# EAGLE design OLM-base-v.REVH-SMT (EAGLE 6.4)
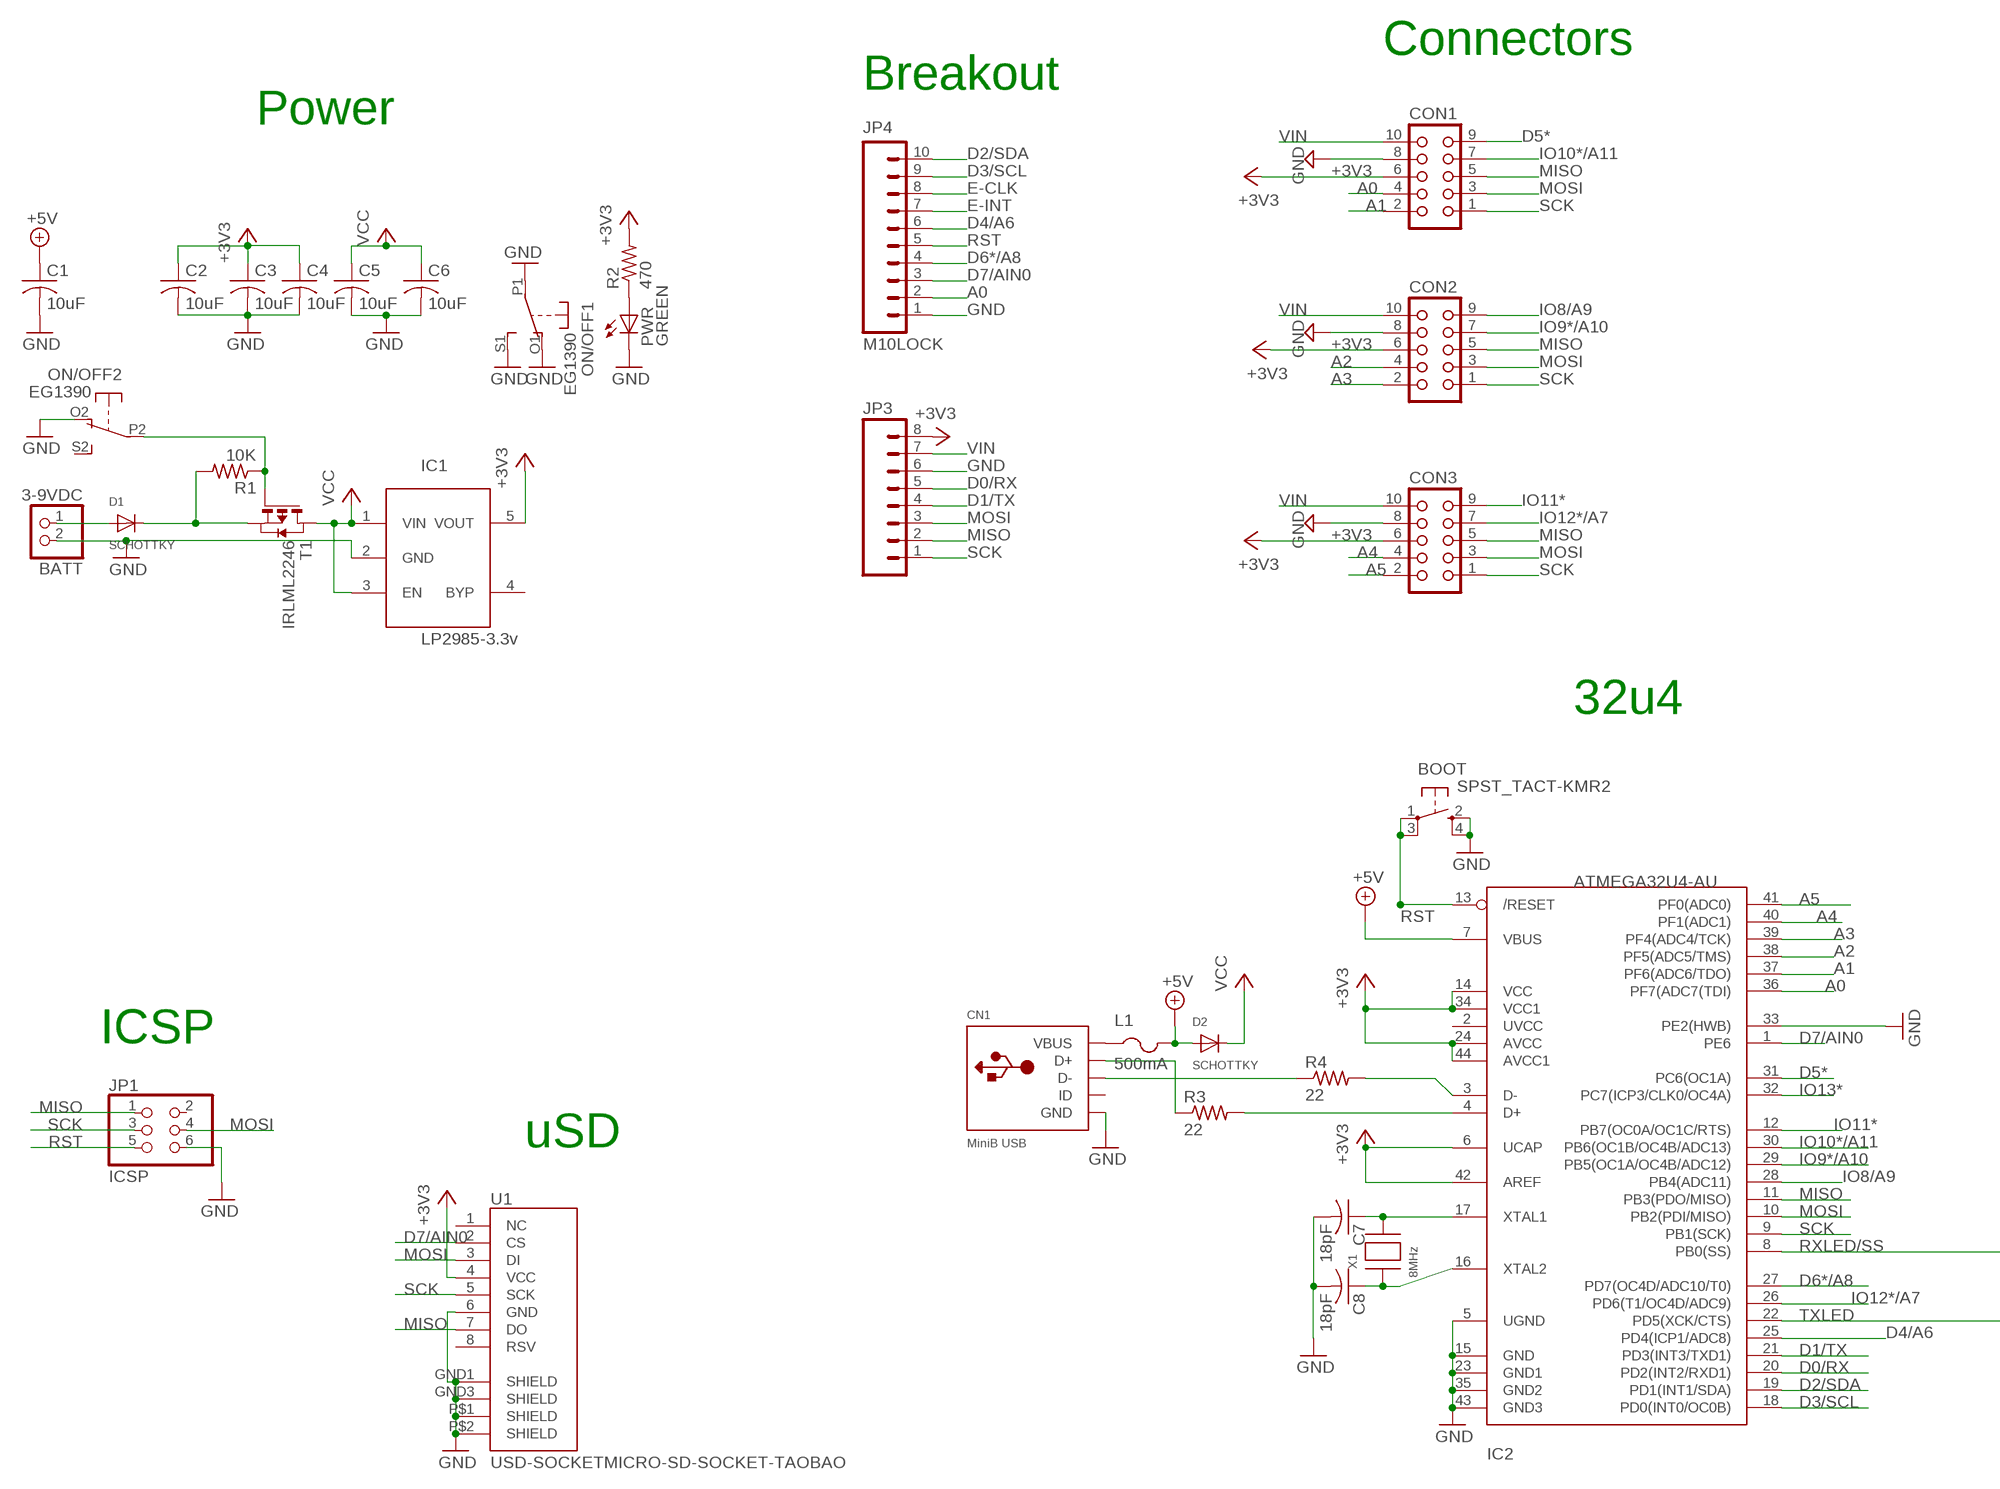
[diagram p0: schematic, sheet 1, part 1 of 2]
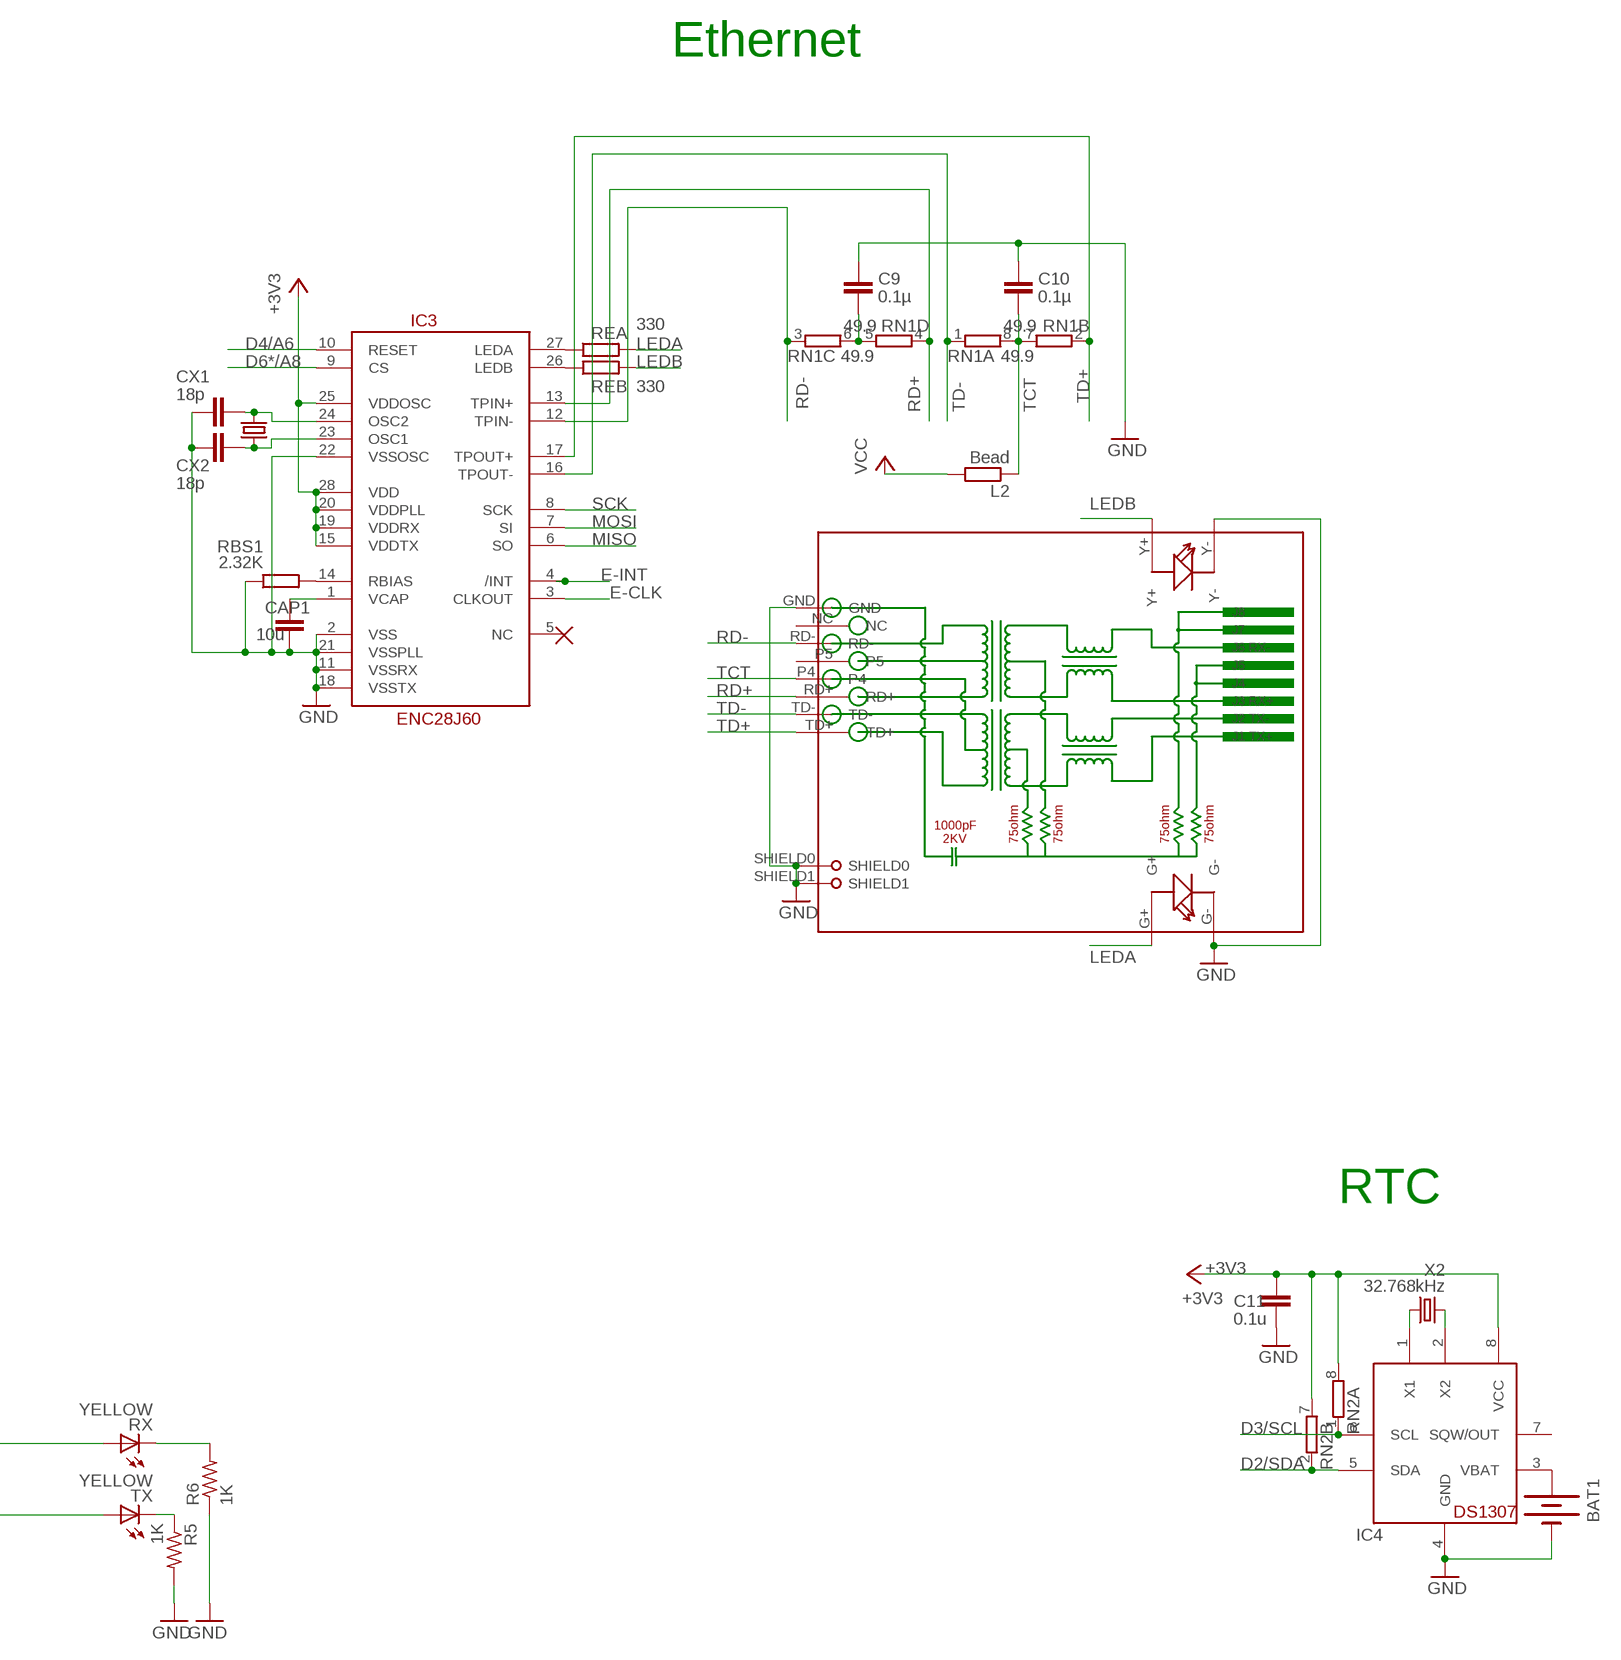
[diagram p1: schematic, sheet 1, part 2 of 2]

## Parts
BAT1  BATTERYBATTERY_12MM_SMT  [BATTCON_12MM_SMT]
BATT  3-9VDC  JST_2PIN-SMT-RA  [JST-PH-2-SMT-RA]
BOOT  SPST_TACT-KMR2  [KMR2]
C1  10uF  C-USC0805K  [C0805K]
C2  10uF  C-USC0805K  [C0805K]
C3  10uF  C-USC0805K  [C0805K]
C4  10uF  C-USC0805K  [C0805K]
C5  10uF  C-USC0805K  [C0805K]
C6  10uF  C-USC0805K  [C0805K]
C7  18pF  C-USC0805K  [C0805K]
C8  18pF  C-USC0805K  [C0805K]
C9  0.1µ  C-EUC0805  [C0805]
C10  0.1µ  C-EUC0805  [C0805]
C11  0.1u  C-EUC0805  [C0805]
CAP1  10u  C-EUC0805  [C0805]
CN1  MiniB USB  USBMINIBLARGE  [USB-MINIB_LARGER]
CON1  CON10L  [CON10L]
CON2  CON10L  [CON10L]
CON3  CON10L  [CON10L]
CX1  18p  C-EUC0805  [C0805]
CX2  18p  C-EUC0805  [C0805]
D1  SCHOTTKY  DIODESOD-123  [SOD-123]
D2  SCHOTTKY  DIODESOD-123  [SOD-123]
IC1  LP2985-3.3v  LP298XS  [SOT23-5L]
IC2  ATMEGA32U4-AU  [TQFP44]
IC3  ENC28J60  ENC28J60SO28LONG  [SOIC28WLONG]
IC4  DS1307  DS1307SOIC  [SO08]
JP1  ICSP  PINHD-2X3  [2X03]
JP3  M08LOCK  [1X08_LOCK]
JP4  M10LOCK  [1X10_LOCK]
L1  500mA  PTCFUSE-1206  [R1206]
L2  Bead  R-EU_R0805  [R0805]
ON/OFF  EG1390  DPDT-EG1390  [EG1390]
PWR  GREEN  LEDCHIPLED_0805  [CHIPLED_0805]
R1  10K  R-US_R0805  [R0805]
R2  470  R-US_R0805  [R0805]
R3  22  R-US_R0805  [R0805]
R4  22  R-US_R0805  [R0805]
R5  1K  R-US_R0805  [R0805]
R6  1K  R-US_R0805  [R0805]
RBS1  2.32K  R-EU_R0805  [R0805]
REA  330  R-EU_R0805  [R0805]
REB  330  R-EU_R0805  [R0805]
RJ1  HR911105A  [HR911105A]
RN1  49.9  4R-NEXB38V  [EXB38V]
RN2  4R-NEXB38V  [EXB38V]
RX  YELLOW  LEDCHIPLED_0805  [CHIPLED_0805]
T1  IRLML2246  PMOSSOT23  [SOT-23]
TX  YELLOW  LEDCHIPLED_0805  [CHIPLED_0805]
U1  USD-SOCKETMICRO-SD-SOCKET-TAOBAO  [MICRO-SD-SOCKET-TAOBAO]
X1  8MHz  XTALNX5032  [NX5032]
X2  32.768kHz  CRYSTALTC26H  [TC26H]
X2A  25MHz  CRYSTAL10.5X4.8  [CRYSTAL-SMD-10.5X4.8-2PIN]

## Nets
+3V3: C2.1 C3.1 C4.1 C11.1 CON1.6 CON2.6 CON3.6 IC1.5(VOUT) IC2.6(UCAP) IC2.14(VCC) IC2.24(AVCC) IC2.34(VCC1) IC2.42(AREF) IC2.44(AVCC1) IC3.15(VDDTX) IC3.19(VDDRX) IC3.20(VDDPLL) IC3.25(VDDOSC) IC3.28(VDD) IC4.8(VCC) JP3.8 R2.2 RN2.7 RN2.8 U1.4(VCC)
+5V: C1.1 D2.A IC2.7(VBUS) L1.2
A0: CON1.4 IC2.36(PF7(ADC7(TDI)) JP4.2
A1: CON1.2 IC2.37(PF6(ADC6/TDO))
A2: CON2.4 IC2.38(PF5(ADC5/TMS))
A3: CON2.2 IC2.39(PF4(ADC4/TCK))
A4: CON3.4 IC2.40(PF1(ADC1))
A5: CON3.2 IC2.41(PF0(ADC0))
D0/RX: IC2.20(PD2(INT2/RXD1)) JP3.5
D1/TX: IC2.21(PD3(INT3/TXD1)) JP3.4
D2/SDA: IC2.19(PD1(INT1/SDA)) IC4.5(SDA) JP4.10 RN2.2
D3/SCL: IC2.18(PD0(INT0/OC0B)) IC4.6(SCL) JP4.9 RN2.1
D4/A6: IC2.25(PD4(ICP1/ADC8)) IC3.10(RESET) JP4.6
D5*: CON1.9 IC2.31(PC6(OC1A))
D6*/A8: IC2.27(PD7(OC4D/ADC10/T0)) IC3.9(CS) JP4.4
D7/AIN0: IC2.1(PE6) JP4.3 U1.2(CS)
E-CLK: IC3.3(CLKOUT) JP4.8
E-INT: IC3.4(/INT) JP4.7
GND: BAT1.P$1(-) BATT.2 BOOT.2(S) BOOT.4(S1) C1.2 C2.2 C3.2 C4.2 C5.2 C6.2 C7.2 C8.2 C9.1 C10.1 C11.2 CAP1.2 CN1.GND CON1.8 CON2.8 CON3.8 CX1.2 CX2.2 IC1.2(GND) IC2.5(UGND) IC2.15(GND) IC2.23(GND1) IC2.33(PE2(HWB)) IC2.35(GND2) IC2.43(GND3) IC3.2(VSS) IC3.11(VSSRX) IC3.18(VSSTX) IC3.21(VSSPLL) IC3.22(VSSOSC) IC4.4(GND) JP1.6 JP3.6 JP4.1 ON/OFF.O1(1:O) ON/OFF.O2(2:O) ON/OFF.P1(1:P) ON/OFF.S1(1:S) PWR.C R5.2 R6.1 RBS1.1 RJ1.G- RJ1.GND RJ1.SHIELD0 RJ1.SHIELD1 RJ1.Y- U1.6(GND) U1.GND1(SHIELD) U1.GND3(SHIELD) U1.P$1(SHIELD) U1.P$2(SHIELD)
IO8/A9: CON2.9 IC2.28(PB4(ADC11))
IO9*/A10: CON2.7 IC2.29(PB5(OC1A/OC4B/ADC12))
IO10*/A11: CON1.7 IC2.30(PB6(OC1B/OC4B/ADC13))
IO11*: CON3.9 IC2.12(PB7(OC0A/OC1C/RTS))
IO12*/A7: CON3.7 IC2.26(PD6(T1/OC4D/ADC9))
IO13*: IC2.32(PC7(ICP3/CLK0/OC4A))
LEDA: REA.2 RJ1.G+
LEDB: REB.2 RJ1.Y+
MISO: CON1.5 CON2.5 CON3.5 IC2.11(PB3(PDO/MISO)) IC3.6(SO) JP1.1 JP3.2 U1.7(DO)
MOSI: CON1.3 CON2.3 CON3.3 IC2.10(PB2(PDI/MISO)) IC3.7(SI) JP1.4 JP3.3 U1.3(DI)
N$1: PWR.A R2.1
N$2: CN1.D+ R3.1
N$3: IC2.3(D-) R4.2
N$4: IC2.4(D+) R3.2
N$5: CN1.D- R4.1
N$6: D1.C R1.2 T1.2(S)
N$7: BATT.1 D1.A
N$8: C7.1 IC2.17(XTAL1) X1.P$2
N$9: C8.1 IC2.16(XTAL2) X1.P$1
N$10: C9.2 RN1.5 RN1.6
N$11: R5.1 TX.C
N$12: R6.2 RX.C
N$13: ON/OFF.P2(2:P) R1.1 T1.3(G)
N$14: IC3.27(LEDA) REA.1
N$15: IC3.26(LEDB) REB.1
N$16: CAP1.1 IC3.1(VCAP)
N$17: IC3.14(RBIAS) RBS1.2
N$18: CX1.1 IC3.24(OSC2) X2A.P$2
N$19: CX2.1 IC3.23(OSC1) X2A.P$1
N$20: BAT1.P$2(+) IC4.3(VBAT)
N$21: IC4.1(X1) X2.2
N$30: IC4.2(X2) X2.1
RD+: IC3.13(TPIN+) RJ1.RD+ RN1.4
RD-: IC3.12(TPIN-) RJ1.RD- RN1.3
RST: BOOT.1(P) BOOT.3(P1) IC2.13(/RESET) JP1.5 JP4.5
RXLED/SS: IC2.8(PB0(SS)) RX.A
SCK: CON1.1 CON2.1 CON3.1 IC2.9(PB1(SCK)) IC3.8(SCK) JP1.3 JP3.1 U1.5(SCK)
TCT: C10.2 L2.1 RJ1.P4 RN1.7 RN1.8
TD+: IC3.17(TPOUT+) RJ1.TD+ RN1.2
TD-: IC3.16(TPOUT-) RJ1.TD- RN1.1
TXLED: IC2.22(PD5(XCK/CTS)) TX.A
VBUS: CN1.VBUS L1.1
VCC: C5.1 C6.1 D2.C IC1.1(VIN) IC1.3(EN) L2.2 T1.1(D)
VIN: CON1.10 CON2.10 CON3.10 JP3.7
Unconnected: CN1.ID IC1.4(BYP) IC2.2(UVCC) IC3.5(NC) IC4.7(SQW/OUT) JP1.2 ON/OFF.S2(2:S) RJ1.NC RJ1.P5 RN2.3 RN2.4 RN2.5 RN2.6 U1.1(NC) U1.8(RSV)

## Notes on the sheet
- Ethernet
- Connectors
- Breakout
- Power
- 32u4
- RTC
- ICSP
- uSD

## Library data of the parts
BAT1 = SparkFunNew:BATTERY: Battery Holders Various common sizes : AA, AAA, 20mm coin cell and 12mm coin cell.
BATT = adafruit:JST_2PIN: JST 2-Pin Connectors of various flavors SMT-RA (S2B-PH-SM4) 4UConnector #17311 SMT (B2B-PH-SM4) THM-RA (S2B-PH) THM (B2B-PH)
BOOT = adafruit:SPST_TACT: SMT 6mm switch, EVQQ2 series http://www.ladyada.net/library/eagle
C1-C8 = adafruit:C-US: CAPACITOR, American symbol
C9 C10 CAP1 CX1 CX2 = resistor:C-EU: CAPACITOR, European symbol
C11 = rcl:C-EU: CAPACITOR, European symbol
CN1 = microbuilder:USB: USB Connectors USBMINIB - Surface Mount Female Mini-B USB Connector 4UConnector: 06564
CON1-CON3 = con-harting:CON10L: CONNECTOR; OC_FARNELL: unknown; OC_NEWARK: unknown
D1 D2 = adafruit:DIODE: Diode SMADIODE - SMA Surface Mount Package 20V 1A Schottky Diode Digikey: 641-1014-6-ND DO-1N4148 - Through Hole Small Current Diode SOD-123 20V 1 A (.5mV Vf) Schottky Diode - Digikey: MBRX120TPMSCT-ND SOD-323 10V 570mA (.38mV Vf, 3ns) Schottky Diode - Digikey: ZLLS410CT-ND SOD-523 30V 30mA Schottky Diode (RB751S-40TE61) - Digikey: RB751S-40TE61CT-ND SOT23-R/W - SOT23 Package (R = Solder Paste/Reflow Ovens, W = Hand-Soldering) BAT54Film 40V 300mA - Digikey: 497-7162-1-ND
IC1 = adafruit:LP298X
IC2 = adaprog:ATMEGA32U4
IC3 = SparkFun:ENC28J60
IC4 = adafruit:DS1307: DS1307 Real time clock (RTC) with battery backup ability. Talk to it via i2c
JP1 = pinhead:PINHD-2X3: PIN HEADER
JP3 = SparkFun-Connectors:M08: Header 8 Standard 8-pin 0.1" header. Use with straight break away headers (SKU : PRT-00116), right angle break away headers (PRT-00553), swiss pins (PRT-00743), machine pins (PRT-00117), and female headers (PRT-00115).
JP4 = SparkFun-Connectors:M10: Header 10 Standard 10-pin 0.1" header. Use with straight break away headers (SKU : PRT-00116), right angle break away headers (PRT-00553), swiss pins (PRT-00743), machine pins (PRT-00117), and female headers (PRT-00115).
L1 = adafruit:PTCFUSE: PTC fuses, resettable thermistors
L2 RBS1 REA REB = rcl:R-EU_: RESISTOR, European symbol
ON/OFF = adafruit:DPDT
PWR RX TX = adafruit:LED: LED OSRAM: - CHIPLED LG R971, LG N971, LY N971, LG Q971, LY Q971, LO R971, LY R971 LH N974, LH R974 LS Q976, LO Q976, LY Q976 LO Q996 - Hyper CHIPLED LW Q18S LB Q993, LB Q99A, LB R99A - SideLED LS A670, LO A670, LY A670, LG A670, LP A670 LB A673, LV A673, LT A673, LW A673 LH A674 LY A675 LS A676, LA A676, LO A676, LY A676, LW A676 LS A679, LY A679, LG A679 - Hyper Micro SIDELED® LS Y876, LA Y876, LO Y876, LY Y876 LT Y87S - SmartLED LW L88C, LW L88S LB L89C, LB L89S, LG L890 LS L89K, LO L89K, LY L89K LS L896, LA L896, LO L896, LY L896 - TOPLED LS T670, LO T670, LY T670, LG T670, LP T670 LSG T670, LSP T670, LSY T670, LOP T670, LYG T670 LG T671, LOG T671, LSG T671 LB T673, LV T673, LT T673, LW T673 LH T674 LS T676, LA T676, LO T676, LY T676, LB T676, LH T676, LSB T676, LW T676 LB T67C, LV T67C, LT T67C, LS T67K, LO T67K, LY T67K, LW E67C LS E67B, LA E67B, LO E67B, LY E67B, LB E67C, LV E67C, LT E67C LW T67C LS T679, LY T679, LG T679 LS T770, LO T770, LY T770, LG T770, LP T770 LB T773, LV T773, LT T773, LW T773 LH T774 LS E675, LA E675, LY E675, LS T675 LS T776, LA T776, LO T776, LY T776, LB T776 LHGB T686 LT T68C, LB T68C - Hyper Mini TOPLED® LB M676 - Mini TOPLED Santana® LG M470 LS M47K, LO M47K, LY M47K Source: http://www.osram.convergy.de/
R1-R6 = adafruit:R-US_: RESISTOR, American symbol
RJ1 = CONNECTER:HR911105A
RN1 RN2 = resistor-dil:4R-N: Array Chip Resistor Source: RS Component / Phycomp; OC_FARNELL: unknown; OC_NEWARK: unknown
T1 = zetex:PMOSSOT23: MOS FET
U1 = SparkFunNew:USD-SOCKET: microSD Socket Push-push type uSD socket. Schematic element and footprint production proven. Spark Fun Electronics SKU : PRT-00127. tDoc lines correctly indicate media card edge positions when inserting (unlocked, locked, depressed).
X1 = adaprog:XTAL
X2 = crystal:CRYSTAL: CRYSTAL; OC_FARNELL: unknown; OC_NEWARK: unknown
X2A = SparkFun:CRYSTAL: Crystals Various standard crystals. Proven footprints. Spark Fun Electronics SKU : COM-00534

## Net classes
0 default: width 0.305 mm, clearance 0.203 mm
1 power: width 0.61 mm, clearance 0.203 mm

## Board
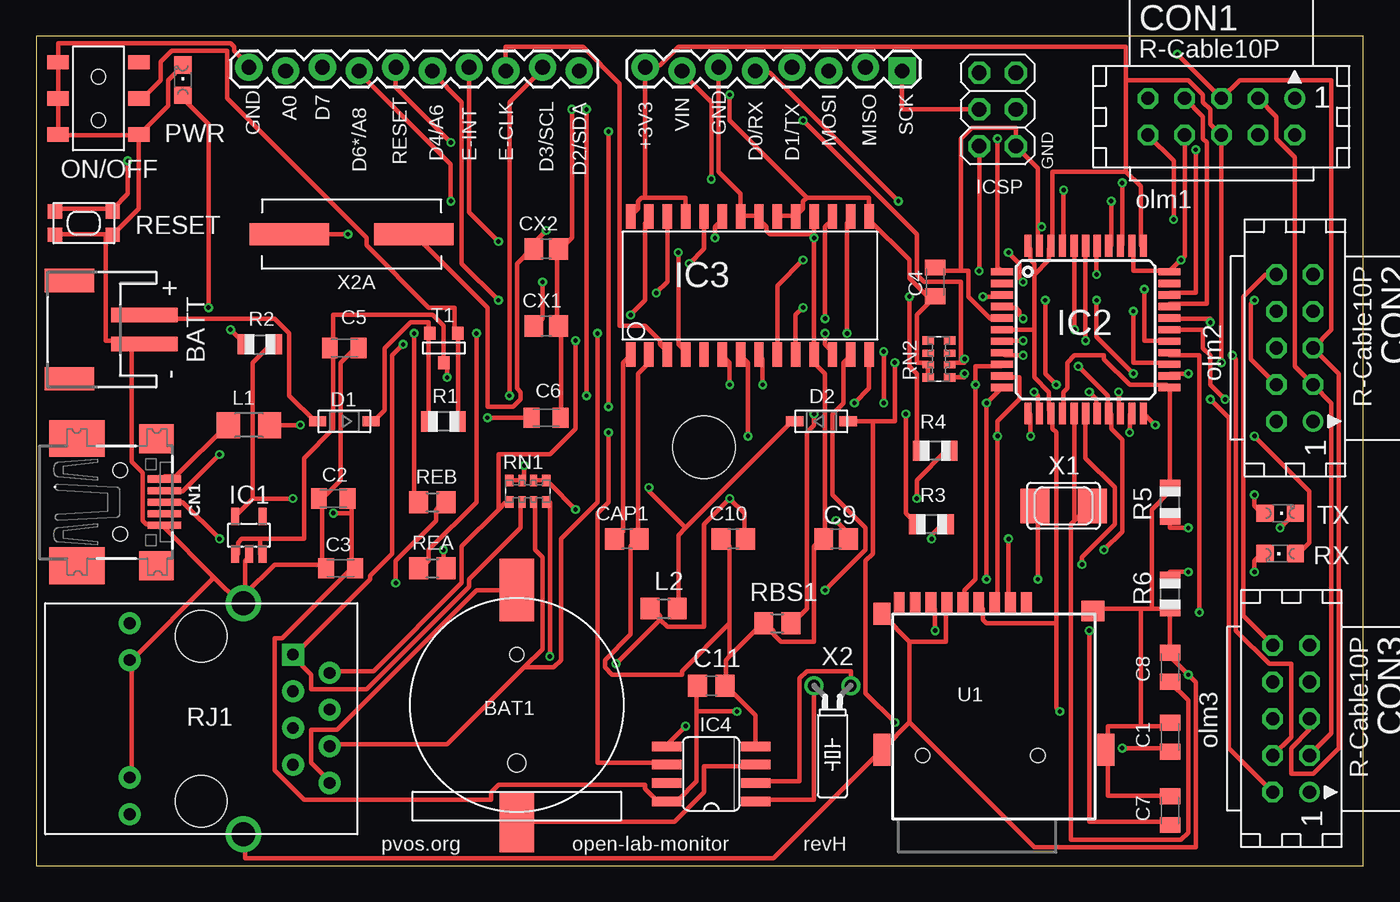
[diagram p2: board, top side]
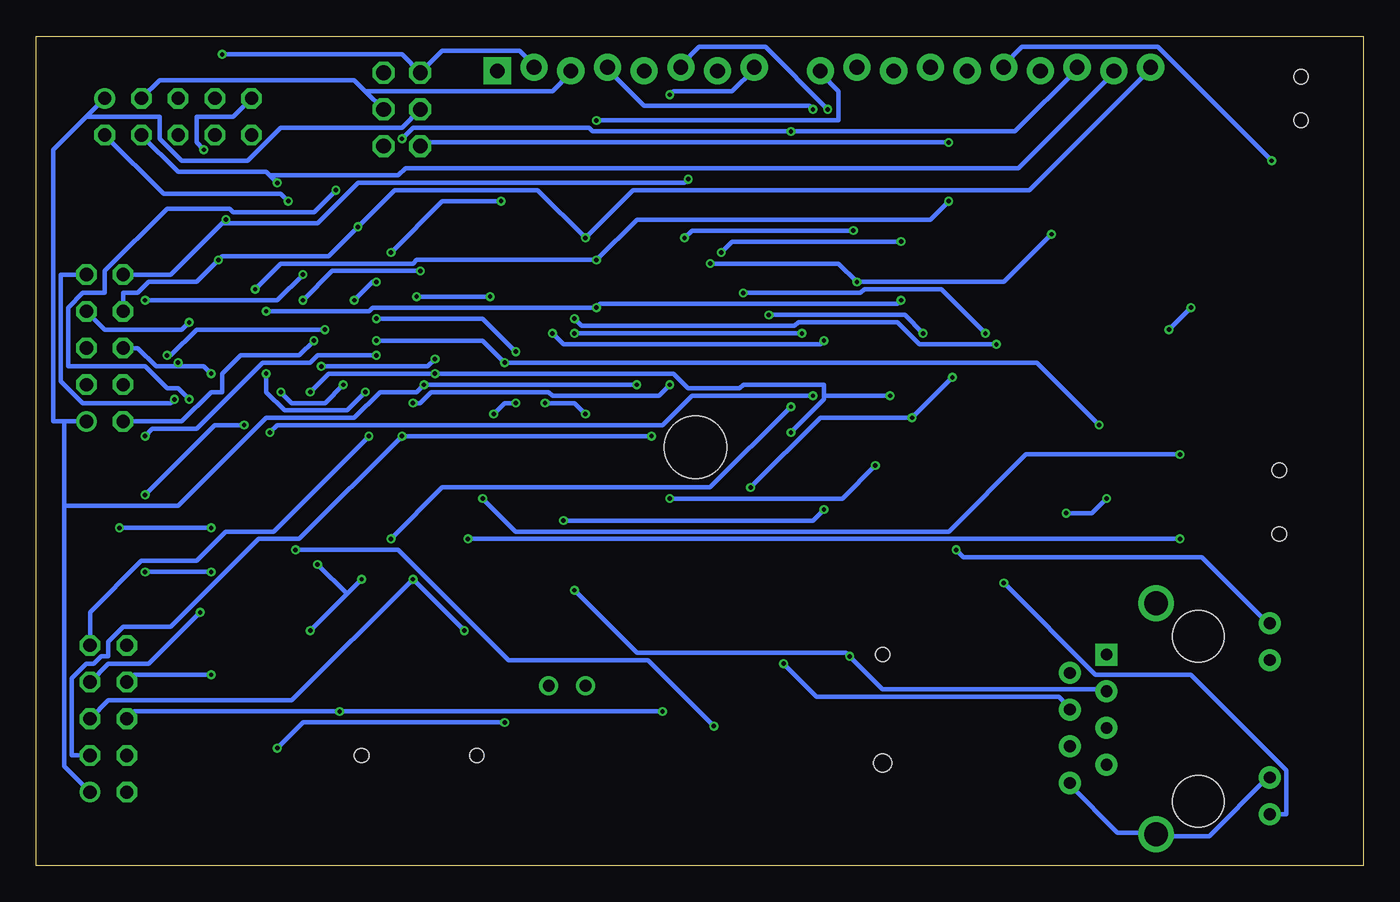
[diagram p3: board, bottom side, seen from below]

Size 91.87 x 57.39 mm. Coordinates in mm from the lower left corner, seen from the top.
Outline: 0,0 91.87,0 91.87,57.39 0,57.39 0,0
Copper layers (1*16): Top 0.035mm / dielectric 1.5mm / Bottom 0.035mm
Design rules "Fusion_eagle_rule_v1.1": minimum track width 6mil, minimum drill 12mil, track to track 6mil, track to pad 6mil, pad to pad 6mil, via to via 6mil, smd to smd 0mil, copper to edge 10mil, drill to drill 10mil, minimum pad ring 10mil, minimum via ring 6mil, stop-mask expansion 2mil, vias tented up to drill 100mil, thermal gap 10mil
Holes 4.32 mm at 46.23,28.96

### Footprints (pad centres in the part's own frame; a part is rotated, then mirrored left to right if it is on the bottom)
BATTCON_12MM_SMT = smd 2.4 x 4.3: P$1 0,11.96 | smd 2.4 x 4.2: P$2 0,-4.1 | hole 0.95: 0,7.5 | hole 1.25: 0,0
JST-PH-2-SMT-RA = smd 1 x 4.6: 1 1,-3.7; 2 -1,-3.7 | smd 1.6 x 3.4: NC1 -3.4,1.5; NC2 3.4,1.5
KMR2 = smd 1 x 1: 1 2,0.8; 2 2,-0.8; 3 -2,0.8; 4 -2,-0.8
C0805K = smd 1.1 x 1.4: 1 -1,0; 2 1,0
C0805 = smd 1.3 x 1.5: 1 -0.85,0; 2 0.85,0
C0805' = smd 1.3 x 1.5: 1 -0.95,0; 2 0.95,0
USB-MINIB_LARGER = smd 0.5 x 2.308: D+ 0,4.064; D- -0.8,4.064; GND 1.6,4.064; ID 0.8,4.064; VBUS -1.6,4.064 | smd 2.54 x 3.81: GND1 -4.4,-2; GND4 4.4,-2 | smd 2 x 2.4: GND2 -4.4,3.5; GND3 4.4,3.5 | hole 1: -2.2,1; 2.2,1
CON10L = drill 0.914: 1 5.08,1.27 | drill 0.914 octagon: 2 5.08,-1.27; 3 2.54,1.27; 4 2.54,-1.27; 5 0,1.27; 6 0,-1.27; 7 -2.54,1.27; 8 -2.54,-1.27; 9 -5.08,1.27; 10 -5.08,-1.27
SOD-123 = smd 1.2 x 0.7: A 1.85,0; C -1.85,0
SOT23-5L = smd 0.55 x 1.2: 1 -0.95,-1.3; 2 0,-1.3; 3 0.95,-1.3; 4 0.95,1.3; 5 -0.95,1.3
TQFP44 = smd 1.5 x 0.5: 1 -5.8,4; 2 -5.8,3.2; 3 -5.8,2.4; 4 -5.8,1.6; 5 -5.8,0.8; 6 -5.8,0; 7 -5.8,-0.8; 8 -5.8,-1.6; 9 -5.8,-2.4; 10 -5.8,-3.2; 11 -5.8,-4; 23 5.8,-4; 24 5.8,-3.2; 25 5.8,-2.4; 26 5.8,-1.6; 27 5.8,-0.8; 28 5.8,0; 29 5.8,0.8; 30 5.8,1.6; 31 5.8,2.4; 32 5.8,3.2; 33 5.8,4 | smd 0.5 x 1.5: 12 -4,-5.8; 13 -3.2,-5.8; 14 -2.4,-5.8; 15 -1.6,-5.8; 16 -0.8,-5.8; 17 0,-5.8; 18 0.8,-5.8; 19 1.6,-5.8; 20 2.4,-5.8; 21 3.2,-5.8; 22 4,-5.8; 34 4,5.8; 35 3.2,5.8; 36 2.4,5.8; 37 1.6,5.8; 38 0.8,5.8; 39 0,5.8; 40 -0.8,5.8; 41 -1.6,5.8; 42 -2.4,5.8; 43 -3.2,5.8; 44 -4,5.8
SOIC28WLONG = smd 0.65 x 1.7: 1 -8.89,-4.78; 2 -7.62,-4.78; 3 -6.35,-4.78; 4 -5.08,-4.78; 5 -3.81,-4.78; 6 -2.54,-4.78; 7 -1.27,-4.78; 8 0,-4.78; 9 1.27,-4.78; 10 2.54,-4.78; 11 3.81,-4.78; 12 5.08,-4.78; 13 6.35,-4.78; 14 7.62,-4.78; 15 7.62,4.78; 16 6.35,4.78; 17 5.08,4.78; 18 3.81,4.78; 19 2.54,4.78; 20 1.27,4.78; 21 0,4.78; 22 -1.27,4.78; 23 -2.54,4.78; 24 -3.81,4.78; 25 -5.08,4.78; 26 -6.35,4.78; 27 -7.62,4.78; 28 -8.89,4.78
SO08 = smd 0.66 x 2.032: 1 -1.905,-3.073; 2 -0.635,-3.073; 3 0.635,-3.073; 4 1.905,-3.073; 5 1.905,3.073; 6 0.635,3.073; 7 -0.635,3.073; 8 -1.905,3.073
2X03 = drill 1.016 octagon: 1 -2.54,-1.27; 2 -2.54,1.27; 3 0,-1.27; 4 0,1.27; 5 2.54,-1.27; 6 2.54,1.27
1X08_LOCK = drill 1.016 pad 1.88 square: 1 0,0.127 | drill 1.016 pad 1.88: 2 2.54,-0.127; 3 5.08,0.127; 4 7.62,-0.127; 5 10.16,0.127; 6 12.7,-0.127; 7 15.24,0.127; 8 17.78,-0.127
1X10_LOCK = drill 1.016 pad 1.88: 1 0,0.127; 2 2.54,-0.127; 3 5.08,0.127; 4 7.62,-0.127; 5 10.16,0.127; 6 12.7,-0.127; 7 15.24,0.127; 8 17.78,-0.127; 9 20.32,0.127; 10 22.86,-0.127
R1206 = smd 1.6 x 1.803: 1 -1.422,0; 2 1.422,0
R0805 = smd 1.3 x 1.5: 1 -0.95,0; 2 0.95,0
EG1390 = smd 1 x 1.5: O1 -2.5,2.8; O2 -2.5,-2.8; P1 0,2.8; P2 0,-2.8; S1 2.5,2.8; S2 2.5,-2.8 | hole 1: 1.5,0; -1.5,0
CHIPLED_0805 = smd 1.2 x 1.2: A 0,-1.05; C 0,1.05
R0805' = smd 1.1 x 1.4: 1 -1,0; 2 1,0
HR911105A = drill 0.813 pad 1.524: G+ 4.953,-6.604; G- 4.953,-4.064; GND -8.89,4.445; NC -6.35,3.175; P4 -8.89,-0.635; P5 -6.35,0.635; RD+ -6.35,-1.905; RD- -8.89,1.905; TD- -8.89,-3.175; Y+ 4.953,6.604; Y- 4.953,4.064 | drill 1.651 pad 2.159: SHIELD0 -2.921,8.001; SHIELD1 -2.921,-8.001 | drill 0.813 pad 1.524 square: TD+ -6.35,-4.445 | hole 3.556: 0,-5.715; 0,5.715
EXB38V = smd 0.6 x 0.8: 1 -1.275,-0.75; 4 1.275,-0.75; 5 1.275,0.75; 8 -1.275,0.75 | smd 0.5 x 0.8: 2 -0.4,-0.75; 3 0.4,-0.75; 6 0.4,0.75; 7 -0.4,0.75
SOT-23 = smd 0.787 x 0.889: 1 0.025,-1.016; 2 -0.94,1.016; 3 0.991,1.016
MICRO-SD-SOCKET-TAOBAO = smd 0.75 x 1.6: 1 2.25,10.5; 2 1.15,10.5; 3 0.05,10.5; 4 -1.05,10.5; 5 -2.15,10.5; 6 -3.25,10.5; 7 -4.35,10.5; 8 -5.45,10.5 | smd 0.7 x 1.6: CD -6.55,10.5 | smd 1.2 x 1.5: GND1 -7.75,9.8 | smd 1.6 x 1.4: GND3 6.85,10 | smd 1.2 x 2.2: P$1 7.75,0.4; P$2 -7.75,0.4 | hole 1: 3.05,0; -4.93,0
NX5032 = smd 2 x 2.4: P$1 2,0; P$2 -2,0
TC26H = drill 0.813: 1 -1.27,0; 2 1.27,0
CRYSTAL-SMD-10.5X4.8-2PIN = smd 5.5 x 1.5: P$1 -4.3,0; P$2 4.3,0

### Placement (x,y rotation side)
BAT1  33.27,7.11 0 top
BATT  3.81,37.08 90 top
BOOT  3.3,44.45 0 top
C1  78.49,8.89 90 top
C2  20.57,25.4 180 top
C3  21.08,20.57 180 top
C4  62.23,40.39 90 top
C5  21.34,35.81 0 top
C6  35.31,30.99 0 top
C7  78.49,3.81 90 top
C8  78.49,13.72 90 top
C9  55.37,22.61 0 top
C10  48.26,22.61 0 top
C11  0.1u  [C0805']  46.74,12.45 0 top
CAP1  40.89,22.61 0 top
CN1  4.83,25.15 270 top
CON1  82.04,51.82 0 top
CON2  87.12,35.81 270 top
CON3  86.87,10.16 270 top
CX1  35.31,37.34 0 top
CX2  35.31,42.67 0 top
D1  21.34,30.73 180 top
D2  54.36,30.73 0 top
IC1  14.73,22.86 0 top
IC2  72.64,37.08 0 top
IC3  50.04,40.13 0 top
IC4  46.74,6.35 90 top
JP1  66.55,52.32 270 top
JP3  59.94,55.12 180 top
JP4  14.73,55.12 0 top
L1  14.73,30.48 0 top
L2  43.43,17.78 0 top
ON/OFF  4.32,53.09 90 top
PWR  10.16,54.36 0 top
R1  10K  [R0805']  28.19,30.73 180 top
R2  470  [R0805']  15.49,36.07 0 top
R3  22  [R0805']  61.98,23.62 180 top
R4  22  [R0805']  62.23,28.7 180 top
R5  1K  [R0805']  78.49,25.15 90 top
R6  1K  [R0805']  78.49,18.8 90 top
RBS1  51.31,16.76 0 top
REA  27.43,20.57 0 top
REB  27.43,25.15 0 top
RJ1  11.43,10.16 180 top
RN1  34.04,25.91 0 top
RN2  62.48,35.05 90 top
RX  86.11,21.59 90 top
T1  28.19,35.81 0 top
TX  86.11,24.38 270 top
U1  66.29,7.62 0 top
X1  71.12,24.89 0 top
X2  55.12,12.45 180 top
X2A  21.84,43.69 180 top

### Tracks (layer width: path | path; a pad name or v marks a point on that pad's centre or on a via)
+3V3  (via drill 0.3)
  Top 0.305: 14.99,25.4 13.97,24.38 IC1.5 | 14.99,25.4 14.99,34.8 16.26,36.07 R2.2 | 21.84,20.57 21.84,24.38 | 21.84,24.38 21.84,25.15 21.59,25.4 C2.1 | 45.72,10.67 45.72,5.84 44.45,4.57 43.69,4.57 IC4.8 43.43,4.57 42.93,4.57 42.16,5.33 42.16,5.59 32,5.59 31.5,5.08 31.5,4.57 18.54,4.57 16.51,6.6 16.51,15.75 17.02,15.75 21.84,20.57 | 45.72,10.67 45.72,12.45 C11.1 | 21.84,20.57 C3.1 | v17.78,25.4 14.99,25.4 | 21.84,24.38 v20.57,24.38 | 52.58,44.96 51.31,44.96 IC3.20 | RN2.8 61.72,34.54 RN2.7 61.72,34.8 60.96,34.8 60.96,38.1 61.98,39.12 | 61.98,39.12 62.23,39.37 C4.1 61.98,39.12 | 61.98,39.12 60.45,40.64 60.45,41.91 57.66,44.7 IC3.15 57.66,46.23 53.34,46.23 | 52.58,44.96 53.09,45.47 53.09,45.97 53.34,46.23 | 52.58,44.96 IC3.19 | 42.16,46.23 44.96,46.23 IC3.25 | 42.16,46.23 41.91,46.23 41.66,45.97 41.66,45.47 41.15,44.96 IC3.28 | 42.16,46.23 JP3.8 42.16,55.37 43.18,55.37 44.45,56.64 75.44,56.64 75.44,54.36 | v79.76,34.04 78.49,34.04 IC2.24 | 69.09,37.08 IC2.6 | 69.09,40.89 69.09,41.66 68.83,41.91 68.83,42.67 IC2.44 | 69.09,40.89 69.09,37.08 | 69.09,37.08 69.09,33.78 70.1,32.77 70.1,31.5 IC2.14 70.36,31.24 70.36,30.23 70.61,29.97 70.61,16.76 | 69.09,40.89 70.1,41.91 70.1,42.67 IC2.42 70.36,42.93 70.36,48.01 75.44,48.01 | 75.44,48.01 76.45,46.99 76.45,42.93 IC2.34 | 70.61,16.76 65.79,16.76 65.53,17.02 65.53,17.78 65.28,18.03 U1.4 | v70.87,10.67 70.61,10.92 70.61,16.76 | 75.44,54.36 79.76,54.36 80.77,53.34 80.77,52.83 81.28,52.32 81.28,51.31 CON1.6 v82.04,34.8 | 75.44,48.01 75.44,54.36 | 53.34,46.23 48.01,51.56 v48.01,53.34 | v48.51,10.67 45.72,10.67
  Bottom 0.305: v17.78,25.4 18.8,24.38 v20.57,24.38 | v79.76,34.04 80.26,34.54 82.04,34.54 | 82.04,34.54 83.57,34.54 84.84,35.81 CON2.6 | CON3.6 85.09,10.67 v70.87,10.67 v48.51,10.67 | v82.04,34.8 82.04,34.54 | v48.01,53.34 47.75,53.59 43.69,53.59 42.16,55.12 JP3.8
+5V  (via drill 0.3)
  Top 0.305: 57.91,30.73 59.44,30.73 v59.44,34.8 | 57.91,30.73 D2.A | v68.33,36.32 67.06,36.32 IC2.7 | v75.18,8.13 78.49,8.13 C1.1 | v59.44,9.91 57.4,11.94 57.4,21.08 57.91,21.59 57.91,30.73 | v18.29,30.48 L1.2
  Bottom 0.305: v68.33,36.32 60.96,36.32 v59.44,34.8 22.61,34.8 v18.29,30.48 | v75.18,8.13 73.41,9.91 v59.44,9.91
A0  (via drill 0.3)
  Top 0.305: v75.18,47.24 75.18,42.93 IC2.36
  Bottom 0.305: 75.69,47.75 75.95,48.01 82.04,48.01 CON1.4 | 75.69,47.75 v75.18,47.24 | 75.69,47.75 66.8,47.75 66.29,48.26 23.88,48.26 17.27,54.86 JP4.2
A1  (via drill 0.3)
  Top 0.305: v74.42,45.97 74.42,42.93 IC2.37
  Bottom 0.305: v74.42,45.97 74.93,46.48 83.06,46.48 CON1.2
A2  (via drill 0.3)
  Top 0.305: v73.41,40.89 73.41,42.67 IC2.38 | v84.33,39.12 84.07,38.86 84.07,35.05 CON2.4
  Bottom 0.305: v73.41,40.89 75.18,39.12 v84.33,39.12
A3  (via drill 0.3)
  Top 0.305: v72.64,36.32 IC2.39
  Bottom 0.305: v72.64,36.32 73.66,35.31 77.72,35.31 78.99,34.04 78.99,32.77 79.76,32.77 81.79,30.73 CON2.2
A4  (via drill 0.3)
  Top 0.305: v71.88,37.08 71.88,42.67 IC2.40 | v82.8,35.31 83.06,35.05 83.06,16.26 85.34,13.97 86.87,13.97 86.87,8.89 CON3.4
  Bottom 0.305: v71.88,37.08 80.77,37.08 82.55,35.31 v82.8,35.31
A5  (via drill 0.3)
  Top 0.305: v71.12,46.74 71.12,42.93 IC2.41 | v81.28,32.26 82.55,30.99 82.55,8.13 CON3.2
  Bottom 0.305: v71.12,46.74 72.64,45.21 78.23,45.21 78.49,45.47 82.8,45.47 87.12,41.15 87.12,39.62 88.65,39.62 89.66,38.61 89.66,34.54 84.33,34.54 82.8,33.02 82.04,33.02 v81.28,32.26
D0/RX  (via drill 0.3)
  Top 0.305: v74.93,32.77 74.93,31.5 IC2.20 | v70.61,33.27 69.85,34.04 v69.85,39.12 | v68.33,40.39 68.07,40.64 68.07,41.66 v67.31,42.42 | v59.69,45.97 50.8,54.86 49.78,54.86 JP3.5
  Bottom 0.305: v74.93,32.77 74.17,32 71.88,32 v70.61,33.27 | v69.85,39.12 68.58,40.39 v68.33,40.39 | v67.31,42.42 63.75,45.97 v59.69,45.97
D1/TX  (via drill 0.3)
  Top 0.305: v75.69,29.97 75.69,31.24 IC2.21 | v38.1,52.32 v38.1,32.51
  Bottom 0.305: v75.69,29.97 75.18,30.48 48.51,30.48 46.48,32.51 v38.1,32.51 | v38.1,52.32 38.35,52.58 49.78,52.58 52.32,55.12 JP3.4
D2/SDA  (via drill 0.3)
  Top 0.305: 64.01,34.8 64.26,34.8 v64.26,35.05 | 64.01,34.8 63.25,34.8 RN2.2 | v72.14,34.54 74.17,32.51 74.17,31.5 IC2.19 74.42,31.24 74.42,30.23 75.18,29.46 75.18,23.11 v73.91,21.84 | v44.96,9.65 43.69,8.38 IC4.5 | v53.09,51.56 60.96,43.69 60.96,40.89 61.47,40.39 64.01,40.39 64.01,34.8
  Bottom 0.305: v64.26,35.05 64.77,34.54 v72.14,34.54 | v44.96,9.65 49.53,14.22 59.18,14.22 66.8,21.84 v73.91,21.84 | v53.09,51.56 36.32,51.56 36.32,53.59 37.59,54.86 JP4.10
D3/SCL  (via drill 0.3)
  Top 0.305: v64.26,34.04 64.26,33.78 63.25,33.78 RN2.1 | v72.9,32.77 73.41,32.26 73.41,31.5 IC2.18 | v39.62,29.97 39.62,25.15 38.86,24.38 38.86,7.11 43.43,7.11 IC4.6 | v32.77,32.51 32.77,52.83 35.05,55.12 JP4.9
  Bottom 0.305: v72.9,32.77 71.63,34.04 v64.26,34.04 47.75,34.04 46.74,33.02 43.18,33.02 42.93,33.27 37.34,33.27 37.34,32.51 | v39.62,29.97 37.34,32.26 37.34,32.51 | 37.34,32.51 v32.77,32.51
D4/A6  (via drill 0.3)
  Top 0.305: v75.95,38.35 75.95,34.8 78.23,34.8 IC2.25 | v53.09,38.61 52.58,38.1 IC3.10 | v32,39.12 29.46,41.66 29.46,52.83 27.43,54.86 JP4.6
  Bottom 0.305: v75.95,38.35 68.83,38.35 68.58,38.61 v53.09,38.61 52.83,38.86 32.26,38.86 v32,39.12
D5*  (via drill 0.3)
  Top 0.305: v80.26,49.53 80.26,39.62 78.49,39.62 IC2.31
  Bottom 0.305: v80.26,49.53 80.77,50.04 80.77,51.82 78.23,51.82 CON1.9
D6*/A8  (via drill 0.3)
  Top 0.305: v76.71,39.88 76.71,36.32 78.23,36.32 IC2.27 | v53.09,41.91 51.31,40.13 IC3.9 | v28.7,45.97 28.7,48.51 22.35,54.86 JP4.4
  Bottom 0.305: v76.71,39.88 74.93,41.66 65.79,41.66 65.53,41.91 v53.09,41.91 50.29,44.7 29.97,44.7 v28.7,45.97
D7/AIN0  (via drill 0.3)
  Top 0.305: v66.55,50.29 66.55,41.4 66.8,41.15 IC2.1 | v67.31,22.61 67.31,18.29 U1.2 | v39.62,50.8 v39.62,31.75
  Bottom 0.305: v66.55,50.29 65.79,51.05 53.59,51.05 53.34,50.8 v39.62,50.8 24.13,50.8 19.81,55.12 JP4.3 | v67.31,22.61 63.75,26.16 45.21,26.16 v39.62,31.75
E-CLK
  Top 0.305: JP4.8 32.51,56.64 37.85,56.64 40.39,54.1 40.39,37.34 42.16,37.34 43.18,36.32 43.18,36.07 43.69,35.56 IC3.3
E-INT  (via drill 0.3)
  Top 0.305: v44.45,42.42 44.45,36.07 44.96,35.56 IC3.4 | v32,43.18 29.97,45.21 JP4.7
  Bottom 0.305: v44.45,42.42 43.69,43.18 v32,43.18
GND  (via drill 0.3)
  Top 0.305: 64.01,41.15 64.52,41.15 64.52,39.37 66.04,37.85 66.8,37.85 IC2.5 | 64.01,41.15 62.23,41.15 C4.2 | 69.34,44.2 69.34,48.26 JP1.6 67.82,51.05 64.77,51.05 64.01,50.29 64.01,41.15 | 69.34,44.2 69.34,42.93 IC2.43 | IC2.35 75.95,42.67 75.95,41.15 78.23,41.15 IC2.33 78.49,41.15 v79.25,41.91 79.5,42.16 CON1.8 | v69.6,44.2 69.34,44.2 | 41.66,22.61 41.66,34.04 42.42,34.8 IC3.2 | 47.75,12.45 49.78,10.41 49.78,8.38 IC4.4 50.04,8.38 | 48.01,14.48 47.75,14.22 47.75,12.45 | 48.01,14.48 50.29,16.76 RBS1.1 50.55,16.76 51.05,16.26 51.05,16 51.56,15.49 53.85,15.49 53.85,22.1 54.36,22.61 C9.1 54.61,22.61 54.61,34.04 53.85,34.8 IC3.11 v53.85,43.43 53.85,43.69 | 47.75,12.45 C11.2 | 48.01,14.48 48.01,16.76 | 48.01,16.76 48.01,22.1 47.5,22.61 C10.1 | 41.66,22.61 41.15,22.1 41.15,16 39.37,14.22 39.37,13.72 39.88,13.21 44.7,13.21 44.7,13.46 48.01,16.76 | 41.66,22.61 CAP1.2 | C6.2 36.32,30.99 36.32,37.34 CX1.2 36.07,37.34 36.07,42.67 CX2.2 36.32,42.67 37.08,43.43 v37.08,52.32 | 48.77,44.96 50.04,44.96 IC3.21 50.04,44.7 50.55,44.2 50.55,43.94 50.8,43.69 53.85,43.69 | 53.85,43.69 IC3.18 | JP3.6 47.24,48.01 48.77,46.48 48.77,44.96 | 48.77,44.96 IC3.22 | 60.45,15.49 58.67,17.27 U1.GND1 | 60.45,15.49 62.99,15.49 62.99,18.03 U1.6 | 60.45,9.91 58.67,8.13 U1.P$2 58.42,7.87 51.05,0.51 14.48,0.51 14.48,2.03 RJ1.SHIELD0 | 60.45,15.49 60.45,9.91 | IC2.15 71.12,31.5 71.12,32.77 71.37,33.02 71.37,34.8 71.88,35.31 73.91,35.31 73.91,35.05 75.69,33.27 78.23,33.27 IC2.23 78.49,33.02 R5.2 78.49,25.91 77.22,24.64 77.22,17.78 | C7.2 78.49,4.83 74.17,4.83 74.17,7.87 U1.P$1 74.17,8.13 74.17,9.65 76.45,9.65
  Top 0.305: 76.45,9.65 78.49,9.65 C1.2 | 78.49,17.78 C8.2 78.49,14.48 v79.76,13.21 80.26,12.7 80.26,1.27 69.09,1.27 60.45,9.91 | 78.49,17.78 77.22,17.78 | 77.22,17.78 76.45,17.78 | 76.45,17.78 73.15,17.78 U1.GND3 | 78.49,17.78 R6.1 | 76.45,17.78 76.45,9.65 | BAT1.P$1 33.27,19.05 30.48,19.05 20.83,9.4 19.05,9.4 19.05,7.11 20.32,5.84 RJ1.GND | ON/OFF.P1 1.52,50.8 ON/OFF.O1 1.52,50.55 7.11,50.55 | ON/OFF.P1 1.52,55.37 ON/OFF.S1 1.52,55.63 1.52,56.9 13.46,56.9 13.72,56.64 13.72,56.39 14.73,55.37 JP4.1 | ON/OFF.P1 | 4.83,43.69 5.08,43.69 BOOT.2 | 4.83,43.69 1.52,43.69 BOOT.4 | PWR.C 10.16,55.37 9.14,54.36 9.14,52.58 7.37,50.8 ON/OFF.O2 7.11,50.55 | 7.11,50.55 7.11,45.47 5.33,43.69 BOOT.2 | 6.6,36.32 4.83,36.32 4.83,43.69 | 6.6,36.32 7.37,36.32 BATT.2 6.6,36.32 | 4.83,43.69 BOOT.2 | 19.81,20.83 19.81,25.4 | 19.81,20.83 20.07,20.57 C3.2 19.81,20.83 | 19.81,25.4 21.08,26.67 21.08,34.8 22.1,35.81 C5.2 | 19.81,25.4 C2.2 | 6.6,14.22 6.6,6.1 RJ1.Y- | 14.48,18.8 14.48,18.29 RJ1.SHIELD1 | 14.48,18.8 14.48,21.08 14.73,21.34 IC1.2 | 12.19,20.07 14.22,18.03 RJ1.SHIELD1 | 12.19,20.07 8.89,23.37 CN1.GND 8.89,23.62 7.62,23.62 7.37,23.88 7.37,27.18 6.6,27.94 6.6,36.32 | 6.6,14.22 12.19,19.81 12.19,20.07 | 6.6,14.22 RJ1.G- | 19.81,20.83 16.51,20.83 14.48,18.8 | 14.48,18.8 RJ1.SHIELD1
  Bottom 0.305: CON2.8 85.85,39.62 84.84,39.62 84.07,40.39 80.77,40.39 v79.25,41.91 78.99,42.16 71.63,42.16 v69.6,44.2 67.06,46.74 57.15,46.74 v53.85,43.43 50.55,46.74 23.11,46.74 14.73,55.12 JP4.1 | v37.08,52.32 41.4,56.64 45.97,56.64 47.24,55.37 JP3.6 | CON3.8 85.09,13.21 v79.76,13.21 | RJ1.GND 20.32,5.59 17.02,2.29 14.48,2.29 RJ1.SHIELD0 14.22,2.03 10.67,2.03 6.6,6.1 RJ1.Y-
IO8/A9  (via drill 0.3)
  Top 0.305: IC2.28 80.77,37.08 80.77,35.81 81.28,35.31 81.28,33.27 v82.3,32.26
  Bottom 0.305: v82.3,32.26 82.55,32 88.65,32 90.17,33.53 90.17,40.89 CON2.9
IO9*/A10  (via drill 0.3)
  Top 0.305: v81.28,37.59 81.28,37.85 78.49,37.85 IC2.29
  Bottom 0.305: v81.28,37.59 81.79,37.08 87.12,37.08 CON2.7
IO10*/A11
  Top 0.305: CON1.7 80.77,51.82 80.77,50.29 81.03,50.04 81.03,38.86 78.49,38.86 IC2.30
IO11*  (via drill 0.3)
  Top 0.305: v68.83,29.72 68.83,31.24 IC2.12
  Bottom 0.305: v68.83,29.72 75.44,23.11 78.74,23.11 80.77,21.08 84.58,21.08 88.14,17.53 CON3.9
IO12*/A7  (via drill 0.3)
  Top 0.305: v80.52,17.53 80.52,35.31 78.49,35.31 IC2.26
  Bottom 0.305: v80.52,17.53 84.07,13.97 86.87,13.97 CON3.7
LEDA  (via drill 0.3)
  Top 0.305: v28.19,21.84 28.19,20.57 REA.2
  Bottom 0.305: v28.19,21.84 27.69,21.34 11.18,21.34 6.6,16.76 RJ1.G+
LEDB  (via drill 0.3)
  Top 0.305: v24.89,19.56 24.89,21.08 27.69,23.88 27.69,24.64 28.19,25.15 REB.2
  Bottom 0.305: v24.89,19.56 18.54,13.21 11.94,13.21 5.33,6.6 5.33,3.56 RJ1.Y+
MISO  (via drill 0.3)
  Top 0.305: v78.99,56.13 CON1.5 83.31,54.36 89.66,54.36 89.66,37.08 CON2.5 90.17,34.04 90.17,8.13 88.39,6.35 86.87,6.35 86.87,8.13 88.14,9.4 CON3.5 | v65.79,19.81 v65.79,32 66.8,33.02 IC2.11 | v62.23,16.26 62.23,17.78 61.98,18.03 U1.7 | v48.01,33.27 48.01,34.8 47.5,35.31 IC3.6
  Bottom 0.305: JP3.2 57.4,55.37 58.42,56.39 63.75,56.39 JP1.1 66.55,56.13 v78.99,56.13 | CON3.5 86.87,11.43 74.17,11.43 v65.79,19.81 v62.23,16.26 | v48.01,33.27 48.77,32.51 56.13,32.51 56.39,32.77 64.52,32.77 65.28,32 v65.79,32
MOSI  (via drill 0.3)
  Top 0.305: IC2.10 67.06,33.78 68.07,33.78 68.07,32.26 66.55,30.73 v66.55,29.72 66.55,18.29 U1.3 | v49.28,29.72 49.28,34.8 48.77,35.31 IC3.7 | CON3.3 89.66,9.14 89.66,32 CON2.3 87.12,34.54 87.12,49.02 85.85,50.29 85.85,51.82 CON1.3
  Bottom 0.305: v49.28,29.72 v66.55,29.72 73.66,22.61 76.45,22.61 82.55,16.51 85.85,16.51 86.87,15.49 86.87,14.48 87.38,14.48 87.88,13.97 88.39,13.97 89.41,12.95 89.41,7.62 CON3.3 | CON1.3 83.31,54.36 69.85,54.36 69.09,53.59 | JP1.4 69.09,53.59 | 69.09,53.59 56.13,53.59 54.86,54.86 JP3.3
N$1  (via drill 0.3)
  Top 0.305: v11.94,38.61 11.94,51.31 10.16,53.09 PWR.A | v13.46,37.08 14.48,36.07 R2.1
  Bottom 0.305: v13.46,37.08 v11.94,38.61
N$2  (via drill 0.3)
  Top 0.305: v61.98,22.61 61.98,22.86 62.74,23.62 R3.1 | v12.7,22.61 10.16,25.15 CN1.D+
  Bottom 0.305: v12.7,22.61 v61.98,22.61
N$3  (via drill 0.3)
  Top 0.305: v60.45,39.37 60.45,34.54 60.96,34.04 60.96,28.96 61.21,28.7 R4.2 | v65.53,39.37 66.8,39.37 IC2.3
  Bottom 0.305: v65.53,39.37 v60.45,39.37
N$4  (via drill 0.3)
  Top 0.305: v60.2,31.24 60.2,24.38 60.96,23.62 R3.2 | v58.67,35.56 v58.67,32 | v68.33,37.85 68.07,38.1 68.07,38.35 67.82,38.61 67.06,38.61 IC2.4
  Bottom 0.305: v60.2,31.24 59.44,32 v58.67,32 | v58.67,35.56 60.96,37.85 v68.33,37.85
N$5  (via drill 0.3)
  Top 0.305: v60.96,25.4 60.96,26.67 62.99,28.7 R4.1 | v12.7,28.45 10.16,25.91 8.89,25.91 CN1.D-
  Bottom 0.305: v60.96,25.4 58.67,23.11 28.7,23.11 23.37,28.45 v12.7,28.45
N$6
  Top 0.305: 27.18,36.83 27.18,30.73 R1.2 | 27.18,36.83 27.18,37.59 25.91,37.59 24.13,35.81 24.13,31.5 23.37,30.73 D1.C | 27.18,36.83 T1.2
N$7
  Top 0.305: D1.A 19.3,30.73 17.53,32.51 17.53,36.83 16.51,37.85 7.62,37.85 BATT.1
N$8  (via drill 0.3)
  Top 0.305: v72.9,16.26 72.9,3.05 78.49,3.05 C7.1 | v69.34,19.81 69.34,24.89 X1.P$2 | IC2.17 72.64,28.19 74.68,26.16 74.68,23.62 72.39,21.34 v72.39,20.83
  Bottom 0.305: v69.34,19.81 70.36,18.8 | 70.36,18.8 v72.9,16.26 | 70.36,18.8 v72.39,20.83
N$9
  Top 0.305: 71.88,23.88 72.9,24.89 X1.P$1 | 71.88,23.88 71.63,23.62 71.63,1.78 79.25,1.78 79.76,2.29 79.76,11.43 78.49,12.7 C8.1 | 71.88,23.88 71.88,31.24 IC2.16
N$10  (via drill 0.3)
  Top 0.305: RN1.6 34.54,26.67 RN1.5 35.56,26.42 v37.34,24.64 | v55.37,23.88 56.13,23.11 56.13,22.61 C9.2
  Bottom 0.305: v37.34,24.64 38.1,23.88 v55.37,23.88
N$11  (via drill 0.3)
  Top 0.305: v86.11,23.37 87.12,24.38 TX.C | v79.76,23.37 78.49,23.37 R5.1
  Bottom 0.305: v79.76,23.37 v86.11,23.37
N$12  (via drill 0.3)
  Top 0.305: v84.33,20.32 84.33,21.08 84.84,21.59 RX.C | v79.76,20.32 78.49,20.32 R6.2
  Bottom 0.305: v79.76,20.32 v84.33,20.32
N$13
  Top 0.305: R1.1 29.21,30.73 29.21,36.83 T1.3 28.96,36.83 28.96,38.61 27.18,38.61 22.86,42.93 22.86,43.43 13.21,53.09 13.21,56.39 9.4,56.39 8.64,55.63 8.64,54.36 7.37,53.09 ON/OFF.P2
N$14  (via drill 0.3)
  Top 0.305: v30.48,36.83 30.48,25.15 27.18,21.84 27.18,21.08 26.67,20.57 REA.1 | v41.15,38.1 42.16,39.12 42.16,44.45 42.42,44.7 IC3.27
  Bottom 0.305: v30.48,36.83 31.75,38.1 v41.15,38.1
N$15  (via drill 0.3)
  Top 0.305: v26.16,36.83 26.16,25.4 26.42,25.15 REB.1 | v42.93,39.62 43.69,40.39 IC3.26
  Bottom 0.305: v26.16,36.83 29.21,39.88 34.54,39.88 34.8,39.62 v42.93,39.62
N$16
  Top 0.305: CAP1.1 40.13,22.61 40.64,23.11 40.64,34.8 41.15,35.31 IC3.1
N$17  (via drill 0.3)
  Top 0.305: v53.85,31.24 53.85,30.48 53.34,29.97 53.34,17.78 52.32,16.76 RBS1.2 | v56.64,32 57.66,33.02 IC3.14
  Bottom 0.305: v53.85,31.24 54.61,32 v56.64,32
N$18  (via drill 0.3)
  Top 0.305: v35.05,40.39 35.05,37.85 34.54,37.34 CX1.1 | v45.21,41.66 46.23,42.67 IC3.24 | v21.59,43.69 X2A.P$2
  Bottom 0.305: v45.21,41.66 36.32,41.66 v35.05,40.39 24.89,40.39 v21.59,43.69
N$19  (via drill 0.3)
  Top 0.305: X2A.P$1 26.16,43.69 31.24,38.61 31.24,31.75 33.02,31.75 33.53,32.26 33.53,32.77 33.27,33.02 33.27,41.66 34.29,42.67 CX2.1 34.54,42.67 34.54,43.18 v35.31,43.94 | v46.99,43.43 46.99,44.2 47.5,44.7 IC3.23
  Bottom 0.305: v46.99,43.43 46.48,43.94 v35.31,43.94
N$20
  Top 0.305: IC4.3 49.78,6.86 46.23,6.86 46.23,5.08 44.2,3.05 33.27,3.05 BAT1.P$2
N$21
  Top 0.305: X2.2 53.85,4.57 50.04,4.57 IC4.1
N$30
  Top 0.305: X2.1 56.39,13.46 53.34,13.46 52.83,12.95 52.83,5.84 50.04,5.84 IC4.2
RD+  (via drill 0.3)
  Top 0.305: v35.56,14.48 35.56,25.15 RN1.4 | v54.61,19.05 57.4,21.84 57.4,23.37 55.12,25.65 55.12,31.24 55.88,32 55.88,34.8 56.39,35.31 IC3.13
  Bottom 0.305: RJ1.RD+ 17.78,12.19 33.27,12.19 v35.56,14.48 35.81,14.73 50.29,14.73 v54.61,19.05
RD-  (via drill 0.3)
  Top 0.305: 33.78,13.72 28.45,8.38 20.32,8.38 RJ1.RD- | 33.78,13.72 35.05,14.99 35.05,21.34 34.54,21.84 34.54,25.15 RN1.3 | v54.61,36.83 54.61,36.07 55.12,35.56 IC3.12 | v38.86,36.83 38.86,25.15 36.32,22.61 36.32,14.22 35.81,13.72 33.78,13.72
  Bottom 0.305: v38.86,36.83 v54.61,36.83
RST  (via drill 0.3)
  Top 0.305: v69.09,32.77 69.34,32.51 69.34,31.5 IC2.13 | v75.95,34.04 73.41,36.58 v73.41,39.12 | JP1.5 v65.28,41.15 | BOOT.3 1.52,45.47 5.08,45.47 BOOT.1 5.33,45.47 6.35,46.48 v6.35,48.77 | v28.7,50.04 24.89,53.85 JP4.5
  Bottom 0.305: v69.09,32.77 70.36,31.5 74.68,31.5 75.95,32.77 v75.95,34.04 | v73.41,39.12 71.37,41.15 v65.28,41.15 | v6.35,48.77 14.22,56.64 23.62,56.64 24.89,55.37 JP4.5 | JP1.5 65.02,50.04 v28.7,50.04
RXLED/SS  (via drill 0.3)
  Top 0.305: v84.33,29.72 88.14,25.91 88.14,22.35 87.38,21.59 RX.A | v68.33,35.31 67.06,35.31 IC2.8
  Bottom 0.305: v84.33,29.72 83.82,30.23 80.77,30.23 76.2,34.8 72.9,34.8 72.39,35.31 v68.33,35.31
SCK  (via drill 0.3)
  Top 0.305: IC2.9 66.8,34.54 65.02,34.54 v65.02,33.27 65.02,19.81 64.26,19.05 64.26,18.29 U1.5 | v50.29,33.27 50.29,35.05 50.04,35.31 IC3.8 | JP1.3 59.94,52.32 JP3.1
  Bottom 0.305: v50.29,33.27 v65.02,33.27 65.53,32.77 68.07,32.77 69.85,30.99 75.95,30.99 82.04,24.89 89.92,24.89 | CON3.1 89.92,6.86 89.92,24.89 | 89.92,30.73 89.92,24.89 | CON2.1 89.92,30.73 | 88.39,51.82 90.68,49.53 90.68,30.73 89.92,30.73 | 88.39,51.82 CON1.1 | JP1.3 66.55,51.05 74.93,51.05 77.22,48.77 81.79,48.77 83.31,50.29 83.31,51.82 88.39,51.82
TCT  (via drill 0.3)
  Top 0.305: RN1.8 33.53,26.67 RN1.7 33.78,26.67 v33.78,27.69 | C10.2 49.02,22.61 49.02,24.38 v48.01,25.4 46.23,23.62 46.23,16.51 43.69,16.51 43.18,17.02 | 43.18,17.02 43.18,17.27 42.67,17.78 L2.1 | 43.18,17.02 v40.13,13.97
  Bottom 0.305: v33.78,27.69 36.07,25.4 v48.01,25.4 | v40.13,13.97 37.85,11.68 21.08,11.68 20.32,10.92 RJ1.P4
TD+  (via drill 0.3)
  Top 0.305: 17.78,14.48 19.05,13.21 19.05,12.19 22.86,12.19 29.97,19.3 29.97,19.81 33.53,23.37 33.53,25.15 RN1.2 | v54.61,37.85 54.61,44.2 55.12,44.7 IC3.17 | v25.4,36.07 24.64,35.31 24.64,21.59 23.11,20.07 23.11,19.81 17.78,14.48 | 17.78,14.48 RJ1.TD+
  Bottom 0.305: v54.61,37.85 54.1,37.34 39.37,37.34 39.12,37.59 32.26,37.59 30.73,36.07 v25.4,36.07
TD-  (via drill 0.3)
  Top 0.305: 32,24.64 29.46,22.1 29.46,19.56 23.37,13.46 20.32,13.46 RJ1.TD- | 32,24.64 32.51,25.15 RN1.1 | v56.13,36.83 56.13,44.45 56.39,44.7 IC3.16 | v37.34,36.32 37.34,30.23 35.56,28.45 32,28.45 32,24.64
  Bottom 0.305: v56.13,36.83 55.37,36.07 37.59,36.07 v37.34,36.32
TXLED  (via drill 0.3)
  Top 0.305: v84.33,25.65 84.33,24.89 84.84,24.38 TX.A | v77.47,30.48 76.71,31.24 IC2.22
  Bottom 0.305: v84.33,25.65 79.5,30.48 v77.47,30.48
VBUS
  Top 0.305: L1.1 13.21,30.48 9.65,26.92 8.89,26.92 CN1.VBUS
VCC  (via drill 0.3)
  Top 0.305: 44.96,23.37 44.45,22.86 44.45,17.78 L2.2 | 44.96,23.37 52.32,30.73 D2.C | 15.49,22.61 14.22,22.61 13.97,22.35 13.97,21.59 IC1.1 | 15.49,22.61 15.49,21.59 IC1.3 | 20.57,35.81 20.57,38.1 27.43,38.1 28.19,37.34 28.19,34.8 T1.1 28.45,34.8 v28.45,33.78 | v31.24,30.99 C6.1 | 15.49,22.61 18.54,22.61 18.54,28.19 20.57,30.23 20.57,35.81 | 20.57,35.81 C5.1 | 44.96,23.37 42.42,25.91 v42.42,26.16
  Bottom 0.305: v28.45,33.78 v31.24,30.99 37.59,30.99 v42.42,26.16
VIN  (via drill 0.3)
  Top 0.305: CON3.10 83.57,17.27 83.57,39.37 85.09,40.89 CON2.10 | CON1.10 78.74,48.77 v78.74,44.7 | v46.74,47.5 46.74,52.83 44.7,54.86 JP3.7
  Bottom 0.305: 78.99,44.45 82.55,40.89 CON2.10 | 78.99,44.45 v78.74,44.7 | v46.74,47.5 46.99,47.24 69.6,47.24 72.39,44.45 78.99,44.45

### Text on the board
tPlace: A0 | D7 | GND | VIN | GND | SCK | GND | +3V3 | MOSI | MISO | RESET | D4/A6 | E-INT | E-CLK | D0/RX | D1/TX | D6*/A8 | D3/SCL | D2/SDA | ICSP | olm1 | RESET | X2A | olm2 | BAT1 | olm3 | pvos.org | open-lab-monitor | revH